# EAGLE design input (EAGLE 7.2.0)
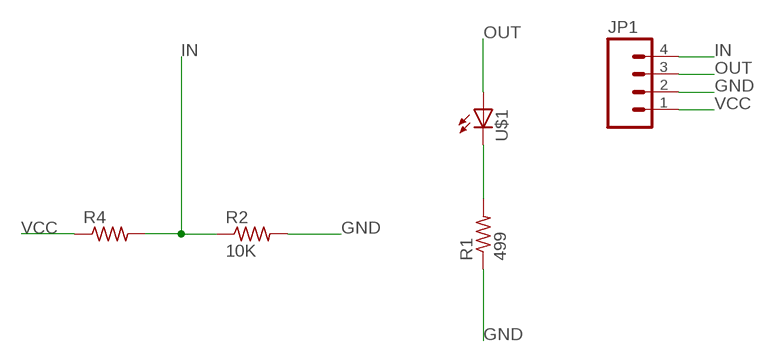
[diagram p0: schematic, sheet 1]

## Parts
JP1  M04SMD  [1X04-SMD]
R1  499  RESISTOR1206  [1206]
R2  10K  RESISTOR1206  [1206]
R4  R-US_V526-0  [V526-0]
U$1  LED1206  [1206]

## Nets
GND: JP1.2 R1.1 R2.2
IN: JP1.4 R2.1 R4.2
N$1: R1.2 U$1.2(C)
OUT: JP1.3 U$1.1(A)
VCC: JP1.1 R4.1

## Library data of the parts
JP1 = 01_SparkFun:M04: Header 4 Standard 4-pin 0.1" header. Use with straight break away headers (SKU : PRT-00116), right angle break away headers (PRT-00553), swiss pins (PRT-00743), machine pins (PRT-00117), and female headers (PRT-00115). Molex polarized connector foot print use with SKU : PRT-08231 with associated crimp pins and housings.
R1 R2 = 01_FAB_Hello:RESISTOR
R4 = 01_adafruit:R-US_: RESISTOR, American symbol
U$1 = 01_FAB_Hello:LED

## Board
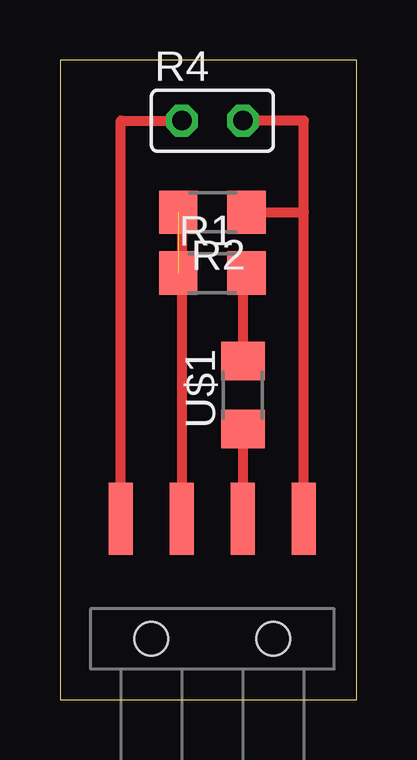
[diagram p1: board, top side]

Size 12.37 x 26.66 mm. Coordinates in mm from the lower left corner, seen from the top.
Outline: 0,0 12.37,0 12.37,26.66 0,26.66 0,0
Copper layers (1*16): Top 0.035mm / dielectric 1.5mm / Bottom 0.035mm
Design rules "default": minimum track width 10mil, minimum drill 24mil, track to track 8mil, track to pad 8mil, pad to pad 8mil, via to via 8mil, smd to smd 8mil, copper to edge 40mil, drill to drill 8mil, minimum pad ring 10mil, minimum via ring 8mil, stop-mask expansion 4mil, vias tented up to drill 0mil, thermal gap 10mil

### Footprints (pad centres in the part's own frame; a part is rotated, then mirrored left to right if it is on the bottom)
1X04-SMD = smd 1 x 3: 1 -3.81,5; 2 -1.27,5; 3 1.27,5; 4 3.81,5 | hole 1.4: -2.54,0; 2.54,0
1206 = smd 1.6 x 1.803: 1 -1.422,0; 2 1.422,0
V526-0 = drill 0.813 octagon: 1 -1.27,0; 2 1.27,0

### Placement (x,y rotation side)
JP1  6.35,2.54 0 top
R1  6.35,17.78 0 top
R2  6.35,20.32 180 top
R4  6.35,24.13 0 top
U$1  7.62,12.7 90 top

### Tracks (layer width: path | path; a pad name or v marks a point on that pad's centre or on a via)
GND  (1 unrouted)
  Top 0.406: R2.2 5.08,20.32 JP1.2
IN
  Top 0.406: JP1.4 10.16,20.32 | 10.16,20.32 10.16,24.13 R4.2 | R2.1 10.16,20.32
N$1
  Top 0.406: R1.2 7.62,17.78 U$1.2
OUT
  Top 0.406: U$1.1 JP1.3
VCC
  Top 0.406: JP1.1 2.54,24.13 R4.1